# Altium schematic sheet 19_2_Coupled_PP0.SchDoc
size 863 x 558 mm; DocumentNumber: 2; SheetNumber: 2; SheetTotal: 2; PageSetup: Record=PageOptions|CenterHorizontal=True|CenterVertical=True|PrintScale=0.48|XCorrection=1.00|YCorrection=1.00|PrintKind=0|BorderSize=5000000|LeftOffset=0|BottomOffset=0|Orientation=2|PaperLength=1000|PaperWidth=1000|Scale=100|PaperSource=15|PrintQuality=-3|MediaType=1|DitherType=10|PrintScaleMode=1|PaperKind=11x17|PaperIndex=17
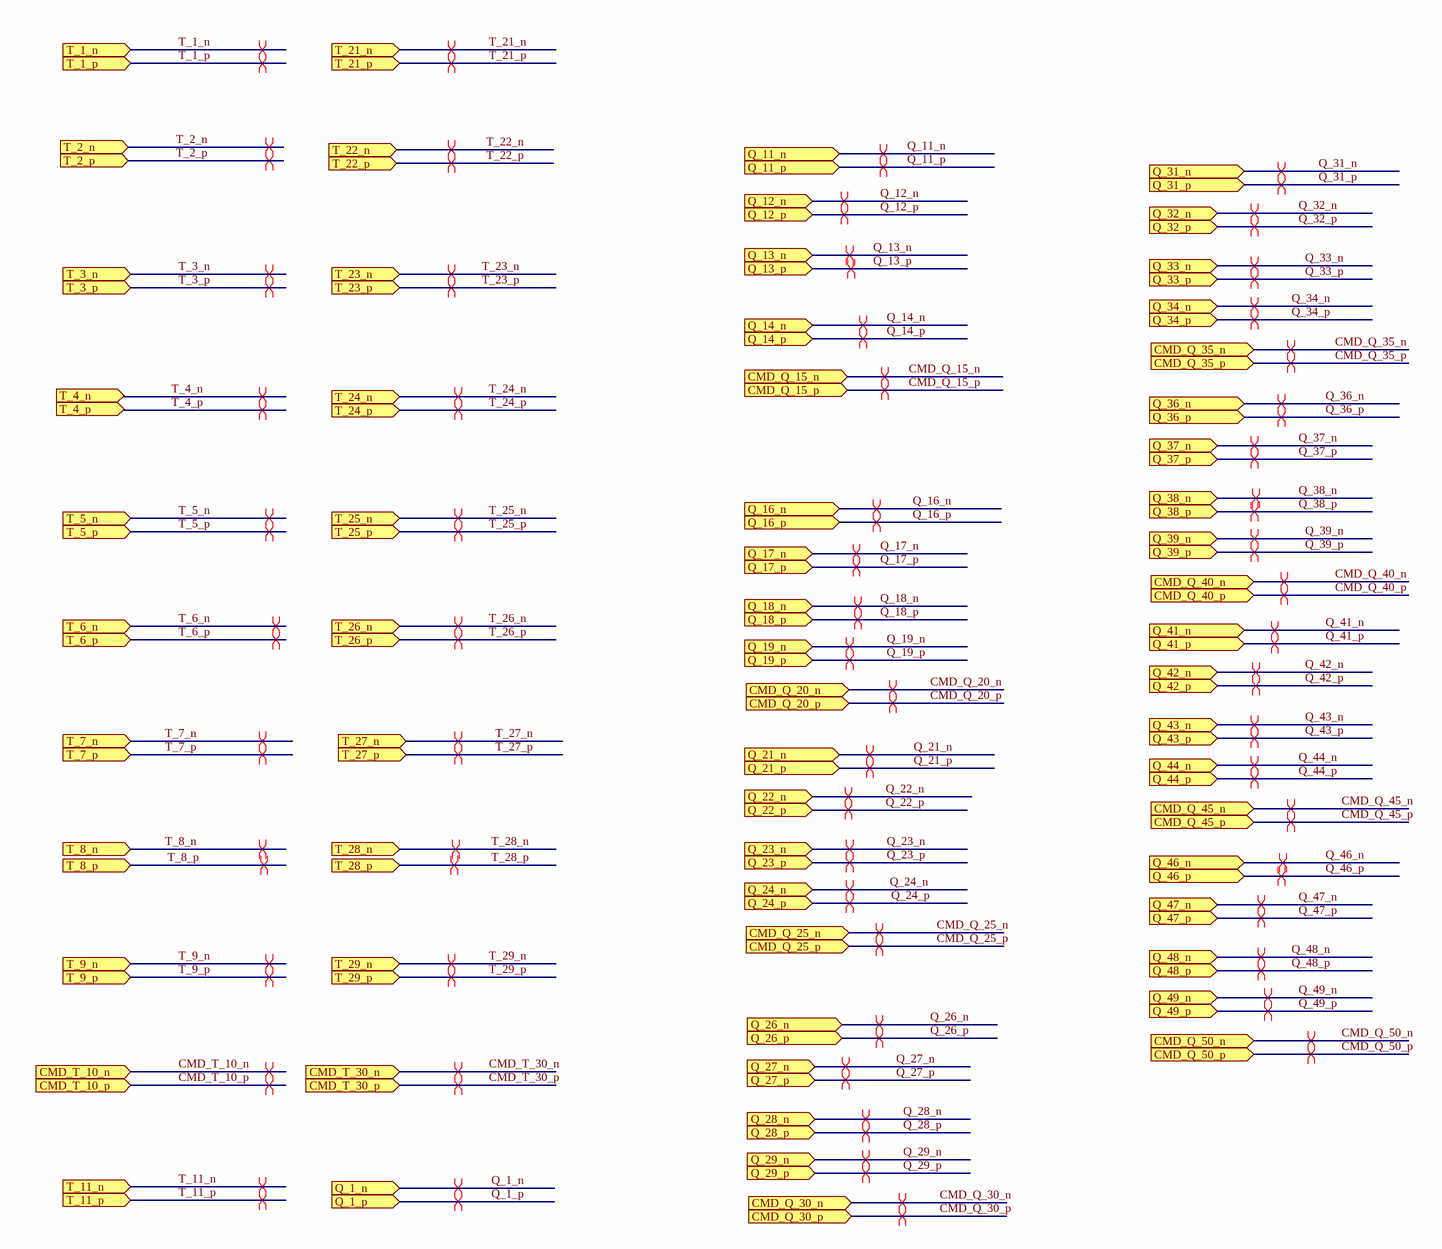
[diagram p0: 19_2_Coupled_PP0.SchDoc, top left]
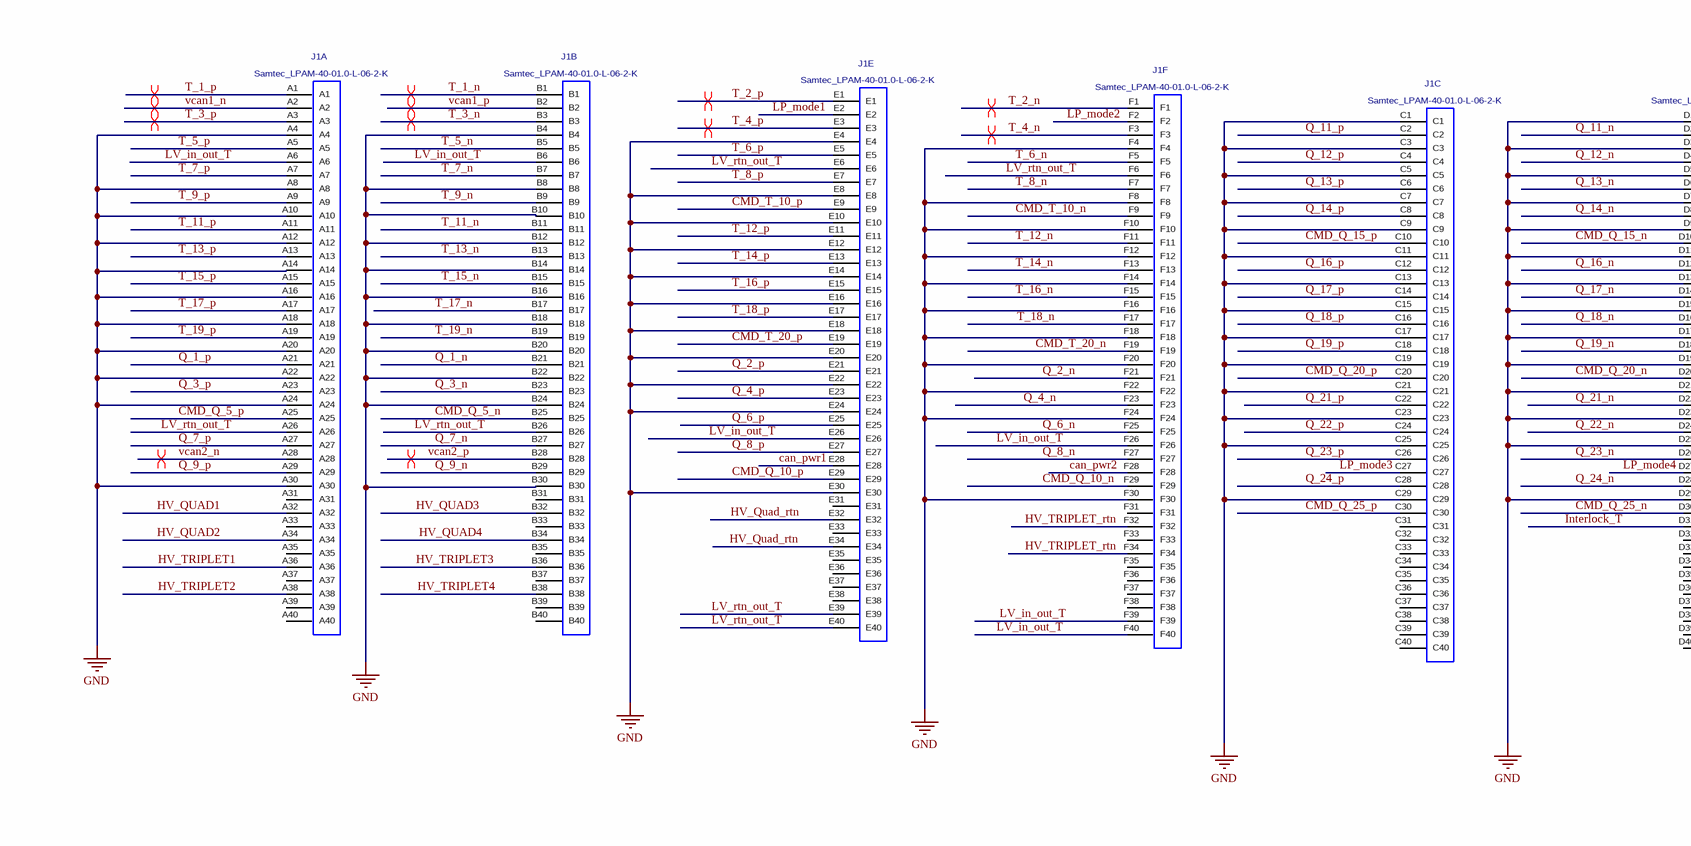
[diagram p1: 19_2_Coupled_PP0.SchDoc, top middle]
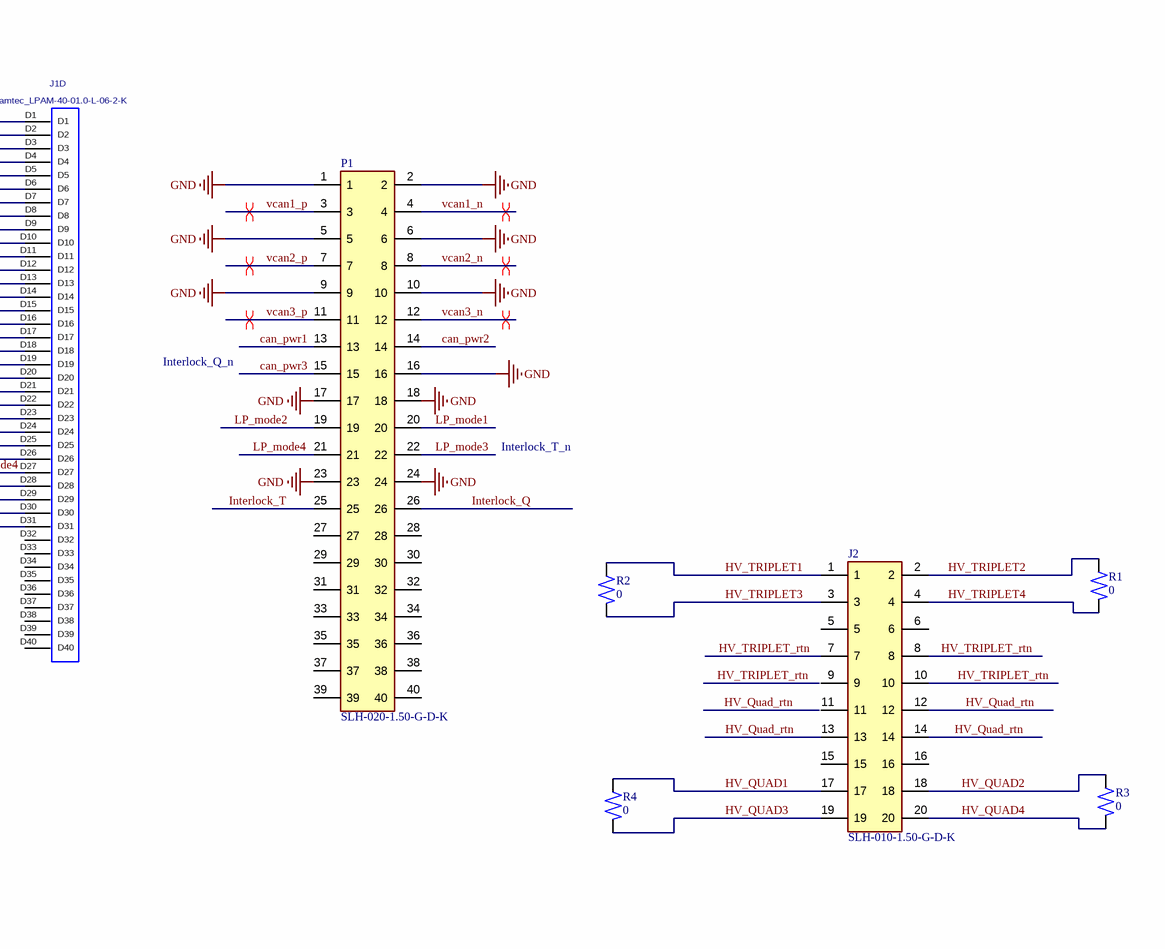
[diagram p2: 19_2_Coupled_PP0.SchDoc, top right]
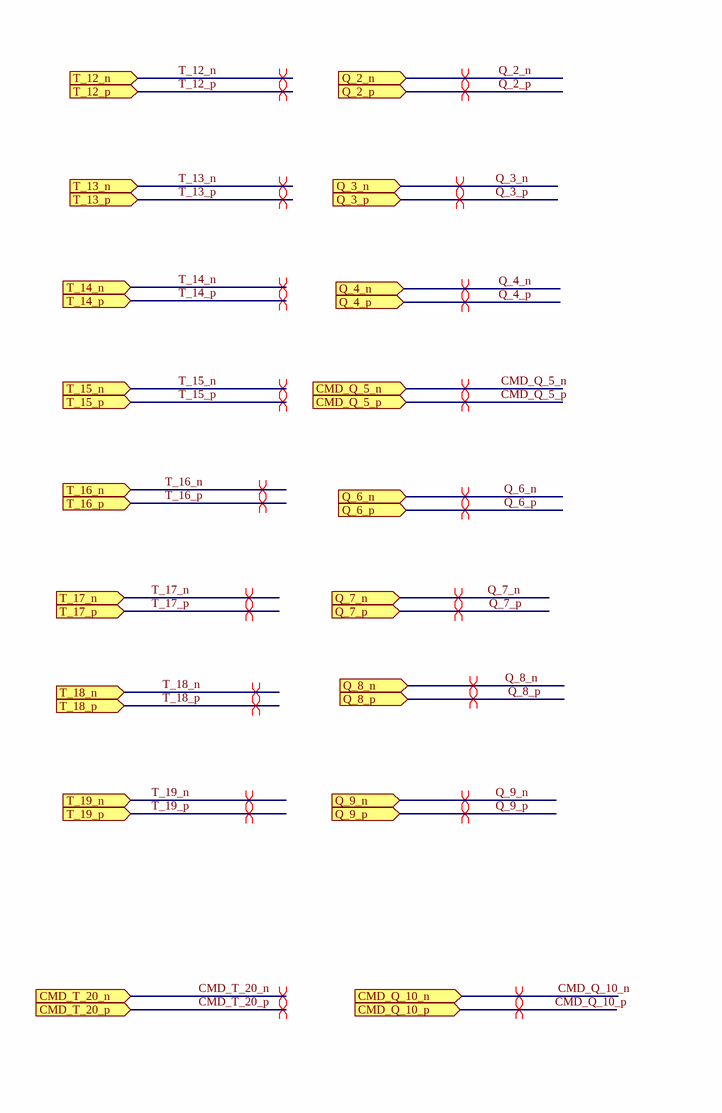
[diagram p3: 19_2_Coupled_PP0.SchDoc, bottom left]
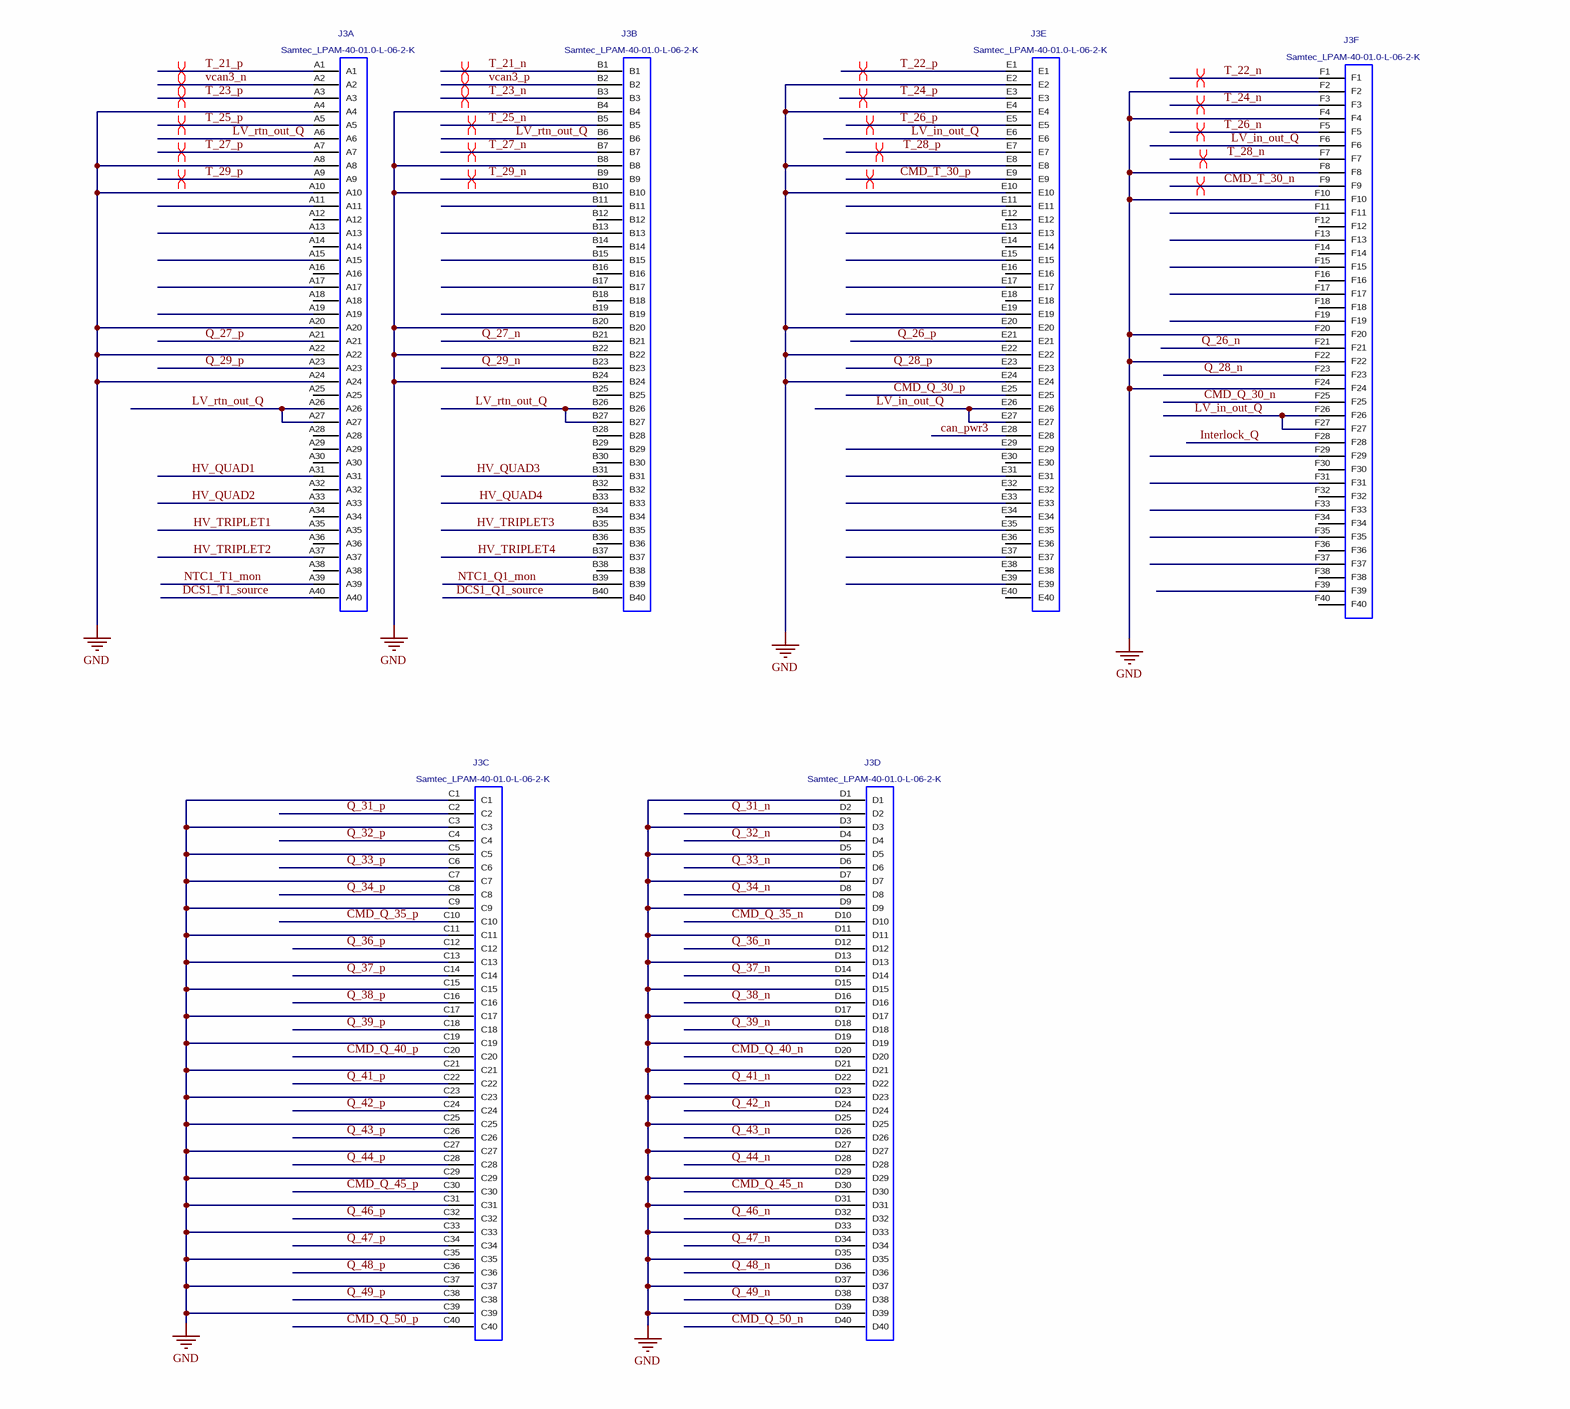
[diagram p4: 19_2_Coupled_PP0.SchDoc, bottom middle]
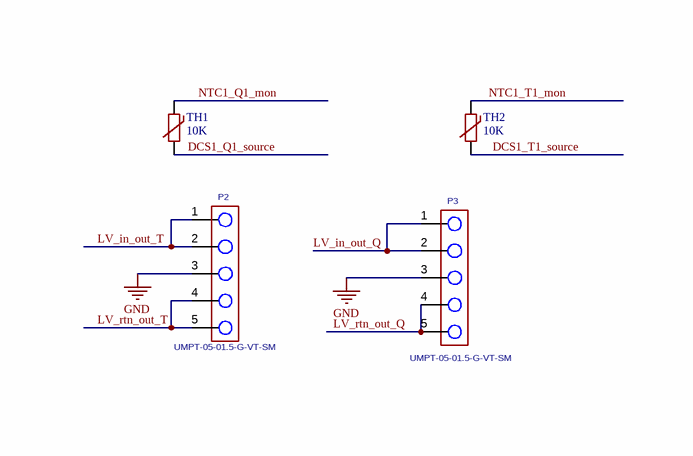
[diagram p5: 19_2_Coupled_PP0.SchDoc, bottom right]

## Parts
J1  Samtec_LPAM-40-01.0-L-06-2-K  [Samtec_LPAM_240Pin_V]  (parts A,B,C,D,E,F of 6)
J2  SLH-010-1.50-G-D-K  [Samtec_SLH-010-1.50-G-D-K]
J3  Samtec_LPAM-40-01.0-L-06-2-K  [Samtec_LPAM_240Pin_V]  (parts A,B,C,D,E,F of 6)
P1  SLH-020-1.50-G-D-K  [Samtec_SLH-020-1.50-G-D-K]
P2  UMPT-05-01.5-G-VT-SM  [Samtec_UMPT_5P_V]
P3  UMPT-05-01.5-G-VT-SM  [Samtec_UMPT_5P_V]
R1  0  [SM0402]
R2  0  [SM0402]
R3  0  [SM0402]
R4  0  [SM0402]
TH1  10K  [SM0805]
TH2  10K  [SM0805]

## Ports
CMD_Q_5_n (in), CMD_Q_5_p (in), CMD_Q_10_n (in), CMD_Q_10_p (in), CMD_Q_15_n (in), CMD_Q_15_p (in), CMD_Q_20_n (in), CMD_Q_20_p (in), CMD_Q_25_n (in), CMD_Q_25_p (in), CMD_Q_30_n (in), CMD_Q_30_p (in), CMD_Q_35_n (in), CMD_Q_35_p (in), CMD_Q_40_n (in), CMD_Q_40_p (in), CMD_Q_45_n (in), CMD_Q_45_p (in), CMD_Q_50_n (in), CMD_Q_50_p (in), CMD_T_10_n (in), CMD_T_10_p (in), CMD_T_20_n (in), CMD_T_20_p (in), CMD_T_30_n (in), CMD_T_30_p (in), Q_1_n (in), Q_1_p (in), Q_2_n (in), Q_2_p (in), Q_3_n (in), Q_3_p (in), Q_4_n (in), Q_4_p (in), Q_6_n (in), Q_6_p (in), Q_7_n (in), Q_7_p (in), Q_8_n (in), Q_8_p (in), Q_9_n (in), Q_9_p (in), Q_11_n (in), Q_11_p (in), Q_12_n (in), Q_12_p (in), Q_13_n (in), Q_13_p (in), Q_14_n (in), Q_14_p (in), Q_16_n (in), Q_16_p (in), Q_17_n (in), Q_17_p (in), Q_18_n (in), Q_18_p (in), Q_19_n (in), Q_19_p (in), Q_21_n (in), Q_21_p (in), Q_22_n (in), Q_22_p (in), Q_23_n (in), Q_23_p (in), Q_24_n (in), Q_24_p (in), Q_26_n (in), Q_26_p (in), Q_27_n (in), Q_27_p (in), Q_28_n (in), Q_28_p (in), Q_29_n (in), Q_29_p (in), Q_31_n (in), Q_31_p (in), Q_32_n (in), Q_32_p (in), Q_33_n (in), Q_33_p (in), Q_34_n (in), Q_34_p (in), Q_36_n (in), Q_36_p (in), Q_37_n (in), Q_37_p (in), Q_38_n (in), Q_38_p (in), Q_39_n (in), Q_39_p (in), Q_41_n (in), Q_41_p (in), Q_42_n (in), Q_42_p (in), Q_43_n (in), Q_43_p (in), Q_44_n (in), Q_44_p (in), Q_46_n (in), Q_46_p (in), Q_47_n (in), Q_47_p (in), Q_48_n (in), Q_48_p (in), Q_49_n (in), Q_49_p (in), T_1_n (in), T_1_p (in), T_2_n (in), T_2_p (in), T_3_n (in), T_3_p (in), T_4_n (in), T_4_p (in), T_5_n (in), T_5_p (in), T_6_n (in), T_6_p (in), T_7_n (in), T_7_p (in), T_8_n (in), T_8_p (in), T_9_n (in), T_9_p (in), T_11_n (in), T_11_p (in), T_12_n (in), T_12_p (in), T_13_n (in), T_13_p (in), T_14_n (in), T_14_p (in), T_15_n (in), T_15_p (in), T_16_n (in), T_16_p (in), T_17_n (in), T_17_p (in), T_18_n (in), T_18_p (in), T_19_n (in), T_19_p (in), T_21_n (in), T_21_p (in), T_22_n (in), T_22_p (in), T_23_n (in), T_23_p (in), T_24_n (in), T_24_p (in), T_25_n (in), T_25_p (in), T_26_n (in), T_26_p (in), T_27_n (in), T_27_p (in), T_28_n (in), T_28_p (in), T_29_n (in), T_29_p (in)

## Nets
GND: J1.A4 J1.A8 J1.A10 J1.A12 J1.A14 J1.A16 J1.A18 J1.A20 J1.A22 J1.A24 J1.A30 J1.B4 J1.B8 J1.B10 J1.B12 J1.B14 J1.B16 J1.B18 J1.B20 J1.B22 J1.B24 J1.B30 J1.C1 J1.C3 J1.C5 J1.C7 J1.C9 J1.C11 J1.C13 J1.C15 J1.C17 J1.C19 J1.C21 J1.C23 J1.C25 J1.C29 J1.D1 J1.D3 J1.D5 J1.D7 J1.D9 J1.D11 J1.D13 J1.D15 J1.D17 J1.D19 J1.D21 J1.D23 J1.D25 J1.D29 J1.E4 J1.E8 J1.E10 J1.E12 J1.E14 J1.E16 J1.E18 J1.E20 J1.E22 J1.E24 J1.E30 J1.F4 J1.F8 J1.F10 J1.F12 J1.F14 J1.F16 J1.F18 J1.F20 J1.F22 J1.F24 J1.F30 J3.A4 J3.A8 J3.A10 J3.A20 J3.A22 J3.A24 J3.B4 J3.B8 J3.B10 J3.B20 J3.B22 J3.B24 J3.C1 J3.C3 J3.C5 J3.C7 J3.C9 J3.C11 J3.C13 J3.C15 J3.C17 J3.C19 J3.C21 J3.C23 J3.C25 J3.C27 J3.C29 J3.C31 J3.C33 J3.C35 J3.C37 J3.C39 J3.D1 J3.D3 J3.D5 J3.D7 J3.D9 J3.D11 J3.D13 J3.D15 J3.D17 J3.D19 J3.D21 J3.D23 J3.D25 J3.D27 J3.D29 J3.D31 J3.D33 J3.D35 J3.D37 J3.D39 J3.E2 J3.E4 J3.E8 J3.E10 J3.E20 J3.E22 J3.E24 J3.F2 J3.F4 J3.F8 J3.F10 J3.F20 J3.F22 J3.F24 P1.1 P1.2 P1.5 P1.6 P1.9 P1.10 P1.16 P1.17 P1.18 P1.23 P1.24 P2.3 P3.3
can_pwr1: J1.E28 P1.13
can_pwr2: J1.F28 P1.14
can_pwr3: J3.E28 P1.15
CMD_Q_5_n: J1.B25 ; port CMD_Q_5_n
CMD_Q_5_p: J1.A25 ; port CMD_Q_5_p
CMD_Q_10_n: J1.F29 ; port CMD_Q_10_n
CMD_Q_10_p: J1.E29 ; port CMD_Q_10_p
CMD_Q_15_n: J1.D10 ; port CMD_Q_15_n
CMD_Q_15_p: J1.C10 ; port CMD_Q_15_p
CMD_Q_20_n: J1.D20 ; port CMD_Q_20_n
CMD_Q_20_p: J1.C20 ; port CMD_Q_20_p
CMD_Q_25_n: J1.D30 ; port CMD_Q_25_n
CMD_Q_25_p: J1.C30 ; port CMD_Q_25_p
CMD_Q_30_n: J3.F25 ; port CMD_Q_30_n
CMD_Q_30_p: J3.E25 ; port CMD_Q_30_p
CMD_Q_35_n: J3.D10 ; port CMD_Q_35_n
CMD_Q_35_p: J3.C10 ; port CMD_Q_35_p
CMD_Q_40_n: J3.D20 ; port CMD_Q_40_n
CMD_Q_40_p: J3.C20 ; port CMD_Q_40_p
CMD_Q_45_n: J3.D30 ; port CMD_Q_45_n
CMD_Q_45_p: J3.C30 ; port CMD_Q_45_p
CMD_Q_50_n: J3.D40 ; port CMD_Q_50_n
CMD_Q_50_p: J3.C40 ; port CMD_Q_50_p
CMD_T_10_n: J1.F9 ; port CMD_T_10_n
CMD_T_10_p: J1.E9 ; port CMD_T_10_p
CMD_T_20_n: J1.F19 ; port CMD_T_20_n
CMD_T_20_p: J1.E19 ; port CMD_T_20_p
CMD_T_30_n: J3.F9 ; port CMD_T_30_n
CMD_T_30_p: J3.E9 ; port CMD_T_30_p
DCS1_Q1_source: J3.B40 TH1.2(N2)
DCS1_T1_source: J3.A40 TH2.2(N2)
HV_QUAD1: J1.A32 J2.17 J3.A31 R4.1(N1)
HV_QUAD2: J1.A34 J2.18 J3.A33 R3.1(N1)
HV_QUAD3: J1.B32 J2.19 J3.B31 R4.2(N2)
HV_QUAD4: J1.B34 J2.20 J3.B33 R3.2(N2)
HV_Quad_rtn: J1.E32 J1.E34 J2.12 J2.13 J2.14
HV_TRIPLET1: J1.A36 J2.1 J3.A35 R2.1(N1)
HV_TRIPLET2: J1.A38 J2.2 J3.A37 R1.1(N1)
HV_TRIPLET3: J1.B36 J2.3 J3.B35 R2.2(N2)
HV_TRIPLET4: J1.B38 J2.4 J3.B37 R1.2(N2)
HV_TRIPLET_rtn: J1.F32 J1.F34 J2.7 J2.8 J2.10
Interlock_Q: J3.F28 P1.26
Interlock_T: J1.D31 P1.25
LP_mode1: J1.E2 P1.20
LP_mode2: J1.F2 P1.19
LP_mode3: J1.C27 P1.22
LP_mode4: J1.D27 P1.21
LV_in_out_Q: J3.E6 J3.E26 J3.E27 J3.F6 J3.F26 J3.F27 P3.1 P3.2
LV_in_out_T: J1.A6 J1.B6 J1.E26 J1.F26 J1.F39 J1.F40 P2.1 P2.2
LV_rtn_out_Q: J3.A6 J3.A26 J3.A27 J3.B6 J3.B26 J3.B27 P3.4 P3.5
LV_rtn_out_T: J1.A26 J1.B26 J1.E6 J1.E39 J1.E40 J1.F6 P2.4 P2.5
NTC1_Q1_mon: J3.B39 TH1.1(N1)
NTC1_T1_mon: J3.A39 TH2.1(N1)
Q_1_n: J1.B21 ; port Q_1_n
Q_1_p: J1.A21 ; port Q_1_p
Q_2_n: J1.F21 ; port Q_2_n
Q_2_p: J1.E21 ; port Q_2_p
Q_3_n: J1.B23 ; port Q_3_n
Q_3_p: J1.A23 ; port Q_3_p
Q_4_n: J1.F23 ; port Q_4_n
Q_4_p: J1.E23 ; port Q_4_p
Q_6_n: J1.F25 ; port Q_6_n
Q_6_p: J1.E25 ; port Q_6_p
Q_7_n: J1.B27 ; port Q_7_n
Q_7_p: J1.A27 ; port Q_7_p
Q_8_n: J1.F27 ; port Q_8_n
Q_8_p: J1.E27 ; port Q_8_p
Q_9_n: J1.B29 ; port Q_9_n
Q_9_p: J1.A29 ; port Q_9_p
Q_11_n: J1.D2 ; port Q_11_n
Q_11_p: J1.C2 ; port Q_11_p
Q_12_n: J1.D4 ; port Q_12_n
Q_12_p: J1.C4 ; port Q_12_p
Q_13_n: J1.D6 ; port Q_13_n
Q_13_p: J1.C6 ; port Q_13_p
Q_14_n: J1.D8 ; port Q_14_n
Q_14_p: J1.C8 ; port Q_14_p
Q_16_n: J1.D12 ; port Q_16_n
Q_16_p: J1.C12 ; port Q_16_p
Q_17_n: J1.D14 ; port Q_17_n
Q_17_p: J1.C14 ; port Q_17_p
Q_18_n: J1.D16 ; port Q_18_n
Q_18_p: J1.C16 ; port Q_18_p
Q_19_n: J1.D18 ; port Q_19_n
Q_19_p: J1.C18 ; port Q_19_p
Q_21_n: J1.D22 ; port Q_21_n
Q_21_p: J1.C22 ; port Q_21_p
Q_22_n: J1.D24 ; port Q_22_n
Q_22_p: J1.C24 ; port Q_22_p
Q_23_n: J1.D26 ; port Q_23_n
Q_23_p: J1.C26 ; port Q_23_p
Q_24_n: J1.D28 ; port Q_24_n
Q_24_p: J1.C28 ; port Q_24_p
Q_26_n: J3.F21 ; port Q_26_n
Q_26_p: J3.E21 ; port Q_26_p
Q_27_n: J3.B21 ; port Q_27_n
Q_27_p: J3.A21 ; port Q_27_p
Q_28_n: J3.F23 ; port Q_28_n
Q_28_p: J3.E23 ; port Q_28_p
Q_29_n: J3.B23 ; port Q_29_n
Q_29_p: J3.A23 ; port Q_29_p
Q_31_n: J3.D2 ; port Q_31_n
Q_31_p: J3.C2 ; port Q_31_p
Q_32_n: J3.D4 ; port Q_32_n
Q_32_p: J3.C4 ; port Q_32_p
Q_33_n: J3.D6 ; port Q_33_n
Q_33_p: J3.C6 ; port Q_33_p
Q_34_n: J3.D8 ; port Q_34_n
Q_34_p: J3.C8 ; port Q_34_p
Q_36_n: J3.D12 ; port Q_36_n
Q_36_p: J3.C12 ; port Q_36_p
Q_37_n: J3.D14 ; port Q_37_n
Q_37_p: J3.C14 ; port Q_37_p
Q_38_n: J3.D16 ; port Q_38_n
Q_38_p: J3.C16 ; port Q_38_p
Q_39_n: J3.D18 ; port Q_39_n
Q_39_p: J3.C18 ; port Q_39_p
Q_41_n: J3.D22 ; port Q_41_n
Q_41_p: J3.C22 ; port Q_41_p
Q_42_n: J3.D24 ; port Q_42_n
Q_42_p: J3.C24 ; port Q_42_p
Q_43_n: J3.D26 ; port Q_43_n
Q_43_p: J3.C26 ; port Q_43_p
Q_44_n: J3.D28 ; port Q_44_n
Q_44_p: J3.C28 ; port Q_44_p
Q_46_n: J3.D32 ; port Q_46_n
Q_46_p: J3.C32 ; port Q_46_p
Q_47_n: J3.D34 ; port Q_47_n
Q_47_p: J3.C34 ; port Q_47_p
Q_48_n: J3.D36 ; port Q_48_n
Q_48_p: J3.C36 ; port Q_48_p
Q_49_n: J3.D38 ; port Q_49_n
Q_49_p: J3.C38 ; port Q_49_p
T_1_n: J1.B1 ; port T_1_n
T_1_p: J1.A1 ; port T_1_p
T_2_n: J1.F1 ; port T_2_n
T_2_p: J1.E1 ; port T_2_p
T_3_n: J1.B3 ; port T_3_n
T_3_p: J1.A3 ; port T_3_p
T_4_n: J1.F3 ; port T_4_n
T_4_p: J1.E3 ; port T_4_p
T_5_n: J1.B5 ; port T_5_n
T_5_p: J1.A5 ; port T_5_p
T_6_n: J1.F5 ; port T_6_n
T_6_p: J1.E5 ; port T_6_p
T_7_n: J1.B7 ; port T_7_n
T_7_p: J1.A7 ; port T_7_p
T_8_n: J1.F7 ; port T_8_n
T_8_p: J1.E7 ; port T_8_p
T_9_n: J1.B9 ; port T_9_n
T_9_p: J1.A9 ; port T_9_p
T_11_n: J1.B11 ; port T_11_n
T_11_p: J1.A11 ; port T_11_p
T_12_n: J1.F11 ; port T_12_n
T_12_p: J1.E11 ; port T_12_p
T_13_n: J1.B13 ; port T_13_n
T_13_p: J1.A13 ; port T_13_p
T_14_n: J1.F13 ; port T_14_n
T_14_p: J1.E13 ; port T_14_p
T_15_n: J1.B15 ; port T_15_n
T_15_p: J1.A15 ; port T_15_p
T_16_n: J1.F15 ; port T_16_n
T_16_p: J1.E15 ; port T_16_p
T_17_n: J1.B17 ; port T_17_n
T_17_p: J1.A17 ; port T_17_p
T_18_n: J1.F17 ; port T_18_n
T_18_p: J1.E17 ; port T_18_p
T_19_n: J1.B19 ; port T_19_n
T_19_p: J1.A19 ; port T_19_p
T_21_n: J3.B1 ; port T_21_n
T_21_p: J3.A1 ; port T_21_p
T_22_n: J3.F1 ; port T_22_n
T_22_p: J3.E1 ; port T_22_p
T_23_n: J3.B3 ; port T_23_n
T_23_p: J3.A3 ; port T_23_p
T_24_n: J3.F3 ; port T_24_n
T_24_p: J3.E3 ; port T_24_p
T_25_n: J3.B5 ; port T_25_n
T_25_p: J3.A5 ; port T_25_p
T_26_n: J3.F5 ; port T_26_n
T_26_p: J3.E5 ; port T_26_p
T_27_n: J3.B7 ; port T_27_n
T_27_p: J3.A7 ; port T_27_p
T_28_n: J3.F7 ; port T_28_n
T_28_p: J3.E7 ; port T_28_p
T_29_n: J3.B9 ; port T_29_n
T_29_p: J3.A9 ; port T_29_p
vcan1_n: J1.A2 P1.4
vcan1_p: J1.B2 P1.3
vcan2_n: J1.A28 P1.8
vcan2_p: J1.B28 P1.7
vcan3_n: J3.A2 P1.12
vcan3_p: J3.B2 P1.11

Not connected (* = marked no-connect by the designer): J1 A31 A33 A35 A37 A39 A40 B31 B33 B35 B37 B39 B40 C31 C32 C33 C34 C35 C36 C37 C38 C39 C40 D32 D33 D34 D35 D36 D37 D38 D39 D40 E31 E33 E35 E36 E37 E38 F31 F33 F35 F36 F37 F38; J2 5 6 9 11 15 16; J3 A11 A12 A13 A14 A15 A16 A17 A18 A19 A25 A28 A29 A30 A32 A34 A36 A38 B11 B12 B13 B14 B15 B16 B17 B18 B19 B25 B28 B29 B30 B32 B34 B36 B38 E11 E12 E13 E14 E15 E16 E17 E18 E19 E29 E30 E31 E32 E33 E34 E35 E36 E37 E38 E39 E40 F11 F12 F13 F14 F15 F16 F17 F18 F19 F29 F30 F31 F32 F33 F34 F35 F36 F37 F38 F39 F40; P1 27 28 29 30 31 32 33 34 35 36 37 38 39 40

## Layout directives
differential pair: CMD_Q_5_n, CMD_Q_5_p, CMD_Q_10_n, CMD_Q_10_p, CMD_Q_15_n, CMD_Q_15_p, CMD_Q_20_n, CMD_Q_20_p, CMD_Q_25_n, CMD_Q_25_p, CMD_Q_30_n, CMD_Q_30_p, CMD_Q_35_n, CMD_Q_35_p, CMD_Q_40_n, CMD_Q_40_p, CMD_Q_45_n, CMD_Q_45_p, CMD_Q_50_n, CMD_Q_50_p, CMD_T_10_n, CMD_T_10_p, CMD_T_20_n, CMD_T_20_p, CMD_T_30_n, CMD_T_30_p, Q_1_n, Q_1_p, Q_2_n, Q_2_p, Q_3_n, Q_3_p, Q_4_n, Q_4_p, Q_6_n, Q_6_p, Q_7_n, Q_7_p, Q_8_n, Q_8_p, Q_9_n, Q_9_p, Q_11_n, Q_11_p, Q_12_n, Q_12_p, Q_13_n, Q_13_p, Q_14_n, Q_14_p, Q_16_n, Q_16_p, Q_17_n, Q_17_p, Q_18_n, Q_18_p, Q_19_n, Q_19_p, Q_21_n, Q_21_p, Q_22_n, Q_22_p, Q_23_n, Q_23_p, Q_24_n, Q_24_p, Q_26_n, Q_26_p, Q_27_n, Q_27_p, Q_28_n, Q_28_p, Q_29_n, Q_29_p, Q_31_n, Q_31_p, Q_32_n, Q_32_p, Q_33_n, Q_33_p, Q_34_n, Q_34_p, Q_36_n, Q_36_p, Q_37_n, Q_37_p, Q_38_n, Q_38_p, Q_39_n, Q_39_p, Q_41_n, Q_41_p, Q_42_n, Q_42_p, Q_43_n, Q_43_p, Q_44_n, Q_44_p, Q_46_n, Q_46_p, Q_47_n, Q_47_p, Q_48_n, Q_48_p, Q_49_n, Q_49_p, T_1_n, T_1_p, T_2_n, T_2_p, T_3_n, T_3_p, T_4_n, T_4_p, T_5_n, T_5_p, T_6_n, T_6_p, T_7_n, T_7_p, T_8_n, T_8_p, T_9_n, T_9_p, T_11_n, T_11_p, T_12_n, T_12_p, T_13_n, T_13_p, T_14_n, T_14_p, T_15_n, T_15_p, T_16_n, T_16_p, T_17_n, T_17_p, T_18_n, T_18_p, T_19_n, T_19_p, T_21_n, T_21_p, T_22_n, T_22_p, T_23_n, T_23_p, T_24_n, T_24_p, T_25_n, T_25_p, T_26_n, T_26_p, T_27_n, T_27_p, T_28_n, T_28_p, T_29_n, T_29_p, vcan1_n, vcan1_p, vcan2_n, vcan2_p, vcan3_n, vcan3_p

## Notes on the sheet
- Interlock_Q_n
- Interlock_T_n
- ENGR
- REV
- DESCRIPTION
- DRFT
- CHKR
- APPV
- DATE
- CAD FILE:
- SHEET     OF
- NOT BE COPIED, PUBLISHED OR OTHERWISE FURTHER DISSEMINATED WITHOUT
- THE DRAWINGS, SPECIFICATIONS AND OTHER DATA HEREIN PROVIDED SHALL
- PRIOR WRITTEN PERMISSION OF STANFORD UNIVERSITY / SLAC.
- ENGR:
- APPROVALS
- REVISION
- PRIOR WRITTEN PERMISSION OF STANFORD UNIVERSITY/SLAC
- DRFT:
- CHKR:
- D
- SLAC Release

## Library data of the parts
J1 J3 = Samtec_LPAM-40-01.0-L-06-2-K: Samtec; LPAM-40-01.0-L-06-2-K, Connector 240Pin Male, LPAM_240Pin_V; Manufacturer Part Number: LPAM-04-01.0-L-06-2-K; Unit_Price_Static: 10.00; MANUFACTURER: SAMTEC; Package / Case: LPAM-240Pin_V
J2 = Samtec_SLH-010-1.50-G-D-K: Samtec; SLH-010-1.50-G-D-K, Connetor 20-Pin SMD; Unit_Price_Static: 2.00; Value: SLH-010-1.50-G-D-K; Manufacturer: Samtec; Package / Case: Samtec_SLH-010-1.50-G-D-K; Manufacturer Part Number: SLH-010-1.50-G-D-K
P1 = Samtec_SLH-020-1.50-G-D-K: Samtec; SLH-020-1.50-G-D-K, Connetor 40-Pin SMD; Unit_Price_Static: 5.00; Manufacturer: Samtec; Manufacturer Part Number: SLH-020-1.50-G-D-K; Package / Case: Samtec_SLH-020-1.50-G-D-K; Value: SLH-020-1.50-G-D-K
P2 P3 = Samtec_UMPT-05-01.5-G-VT-SM: Samtec; UMPT-05-01.5-G-VT-SM, Male Connector 5-Pin, UMPT_5P_V; Unit_Price_Static: 2.00; MANUFACTURER: SAMTEC; Manufacturer Part Number: UMPT-05-01.5-G-VT-SM; Package / Case: Samtec_UMPT_5P_V
R1-R4 = R04020000: Vishay; CRCW04020000Z0ED, CHIP RESISTOR, 0 OHMS 1%, SM0402; Unit_price_Static: 0.01; Manufacturer: VISHAY; Package / Case: SM0402; Manufacturer Part Number: CRCW04020000Z0ED; TOLERANCE: 1%; VALUE: 0
TH1 TH2 = NTC080510K0: TE; NTC0805J10K, Thermister NTC 10K 5% 2-Pin, SM0805; Manufacturer: TE Connectivity; Unit_Price_Static: 0.75; Package / Case: SM0805; Manufacturer Part Number: NTC0805J10K; Tolerance: 5%; Value: 10K